# Altium schematic sheet Lights.SchDoc
size Letter
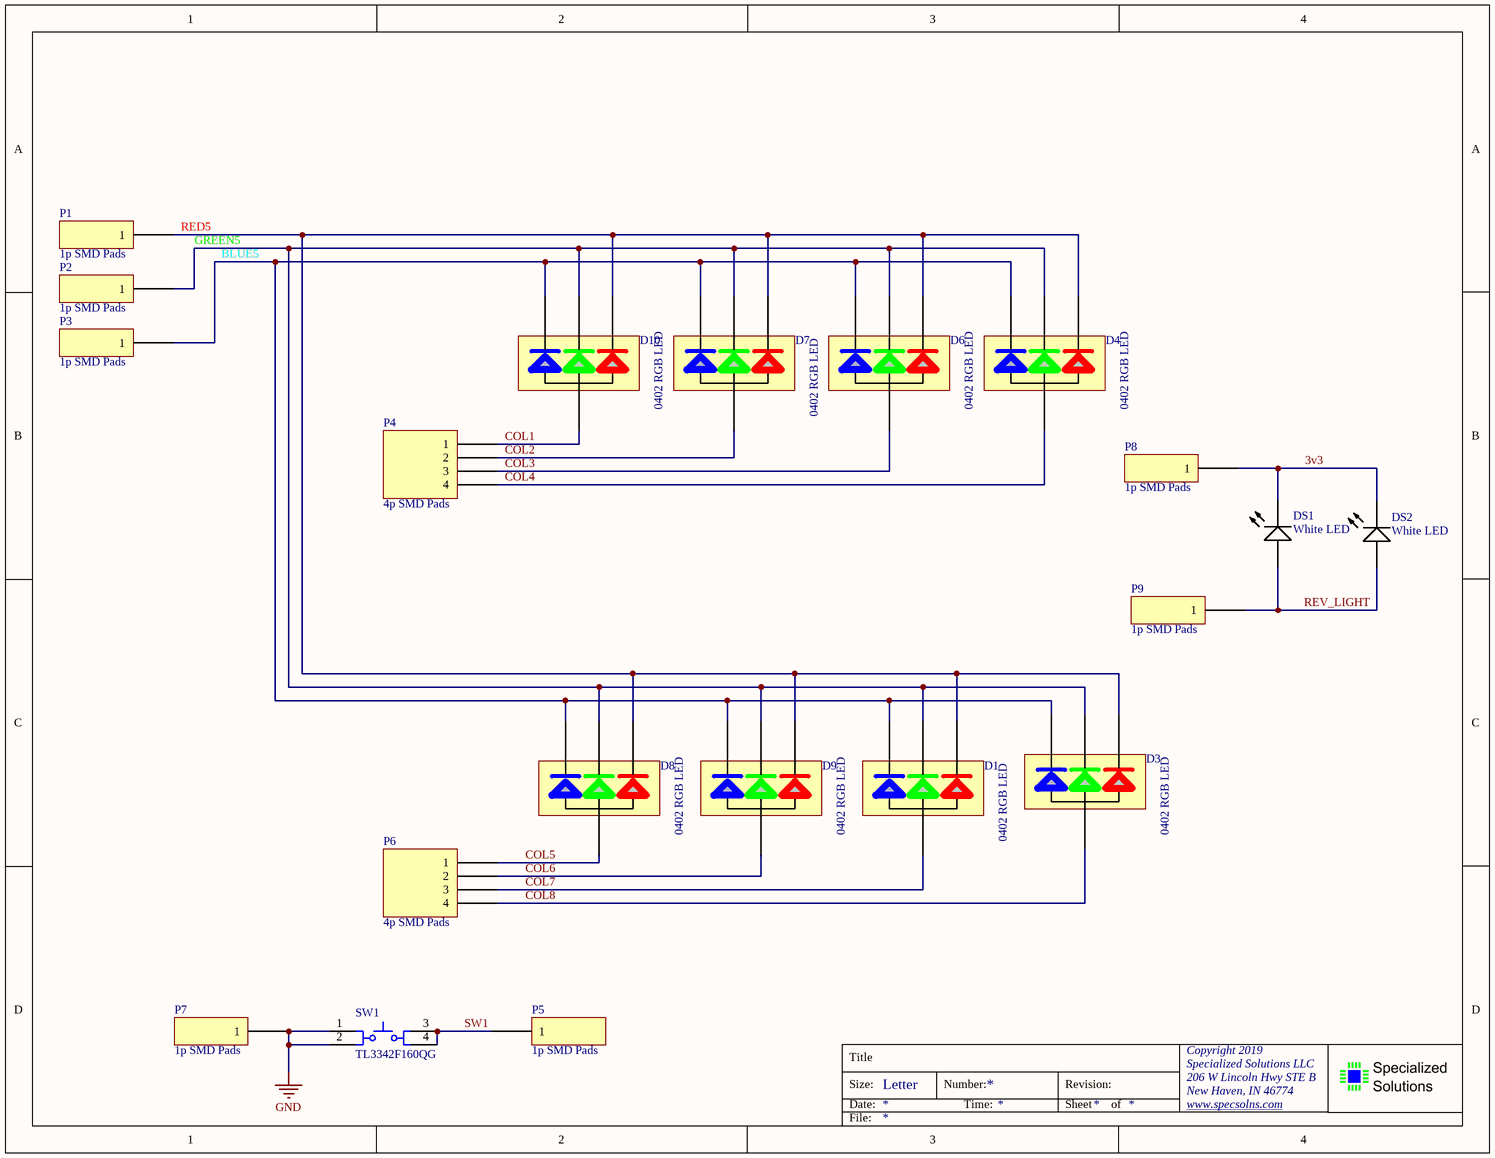
[diagram p0: Lights.SchDoc]

## Parts
D1  0402 RGB LED  [0404 RGB LED]
D3  0402 RGB LED  [0404 RGB LED]
D4  0402 RGB LED  [0404 RGB LED]
D6  0402 RGB LED  [0404 RGB LED]
D7  0402 RGB LED  [0404 RGB LED]
D8  0402 RGB LED  [0404 RGB LED]
D9  0402 RGB LED  [0404 RGB LED]
D10  0402 RGB LED  [0404 RGB LED]
DS1  White LED  [EVRL-0402-2_V]
DS2  White LED  [EVRL-0402-2_V]
P1  1p SMD Pads  [1p SMD pad]
P2  1p SMD Pads  [1p SMD pad]
P3  1p SMD Pads  [1p SMD pad]
P4  4p SMD Pads  [4p SMD pad]
P5  1p SMD Pads  [1p SMD pad]
P6  4p SMD Pads  [4p SMD pad]
P7  1p SMD Pads  [1p SMD pad]
P8  1p SMD Pads  [1p SMD pad]
P9  1p SMD Pads  [1p SMD pad]
SW1  TL3342F160QG  [ESWI-TL3342F160QG_V]

## Nets
GND: P7.1 SW1.1 SW1.2
3v3: DS1.2(K) DS2.2(K) P8.1
BLUE5: D1.4 D3.4 D4.4 D6.4 D7.4 D8.4 D9.4 D10.4 P3.1
COL1: D10.1 P4.1
COL2: D7.1 P4.2
COL3: D6.1 P4.3
COL4: D4.1 P4.4
COL5: D8.1 P6.1
COL6: D9.1 P6.2
COL7: D1.1 P6.3
COL8: D3.1 P6.4
GREEN5: D1.3 D3.3 D4.3 D6.3 D7.3 D8.3 D9.3 D10.3 P2.1
RED5: D1.2 D3.2 D4.2 D6.2 D7.2 D8.2 D9.2 D10.2 P1.1
REV_LIGHT: DS1.1(A) DS2.1(A) P9.1
SW1: P5.1 SW1.3 SW1.4

## Notes on the sheet
- Title
- Size:
- Date:
- Letter
- Number:
- Time:
- Revision:
- Sheet
- of
- Copyright 2019
- Specialized Solutions LLC
- 206 W Lincoln Hwy STE B
- New Haven, IN 46774
- www.specsolns.com <http://www.specsolns.com>
- File:

## Library data of the parts
DS1 DS2 = CMP-2100-03575-1: Chip LED, White, 5 V, 10 mA, 30 mW, -40 to 85 degC, 2-Pin SMD (0402), RoHS, Tape and Reel; Manufacturer: Everlight Electronics; Power Rating: 30mW; Luminous Intensity: 360mcd; Forward Current: 5mA; Forward Voltage: 2.6V; Lens Colour: Yellow; Viewing Angle: 130degrees; Min Operating Temperature: -40degC; Datasheet URL: http://www.everlight.com/file/ProductFile/16-219A-T2D-AR2T1QY-3T.pdf; Case/Package: 0402; Package Description: 2-Pin Surface Mount Device, Body 1 x 0.5 mm; RoHSCompliant: true; Datasheet Version: Rev. 5, 04/2013; Max Operating Temperature: 85degC; Packaging: TapeandReel; Package Reference: 0402; Package Quantity: 3000; Manufacturer URL: http://www.everlight.com/; Illumination Colour: White; Mount: Standard
P1-P3 P5 P7-P9 = 1p SMD
P4 P6 = 4p SMD
SW1 = CMP-1696-00003-1: Switch, Tactile, SPST-NO, 50 mA, 12 V, 4-Pin SMD, RoHS, Tape and Reel; Voltage Rating (DC): 50 V; Tolerance: 20%; Case\Package: Radial; Capacitance: 4.7 uF; Max Operating Temperature: 85 degC; REACH SVHC: No SVHC; Package Quantity: 200; Voltage Rating: 50 V; ComponentLink1Description: Manufacturer URL; ComponentLink2URL: http://spec_sheets.e-switch.com/specs/P010632.pdf; ComponentLink2Description: Datasheet; Height: 11 mm; Lead Pitch: 2 mm; RoHSCompliant: true; Radiation Hardening: No; Pins: 2; Length: 11 mm; DatasheetVersion: Rev. I, 12/2010; PackageReference: TL3342F160QG; ComponentLink1URL: http://www.e-switch.ch/en/; PackageDescription: 4-Pin Surface Mount Device, Body 5 x 5 mm, Pitch 6.3 mm; Mount: Through Hole; Diameter: 5 mm; Packaging: Bulk; Min Operating Temperature: -40 degC; Width: 0 inch